# EAGLE design MDM_V3_ControlBoard_C (EAGLE 7.5.0)
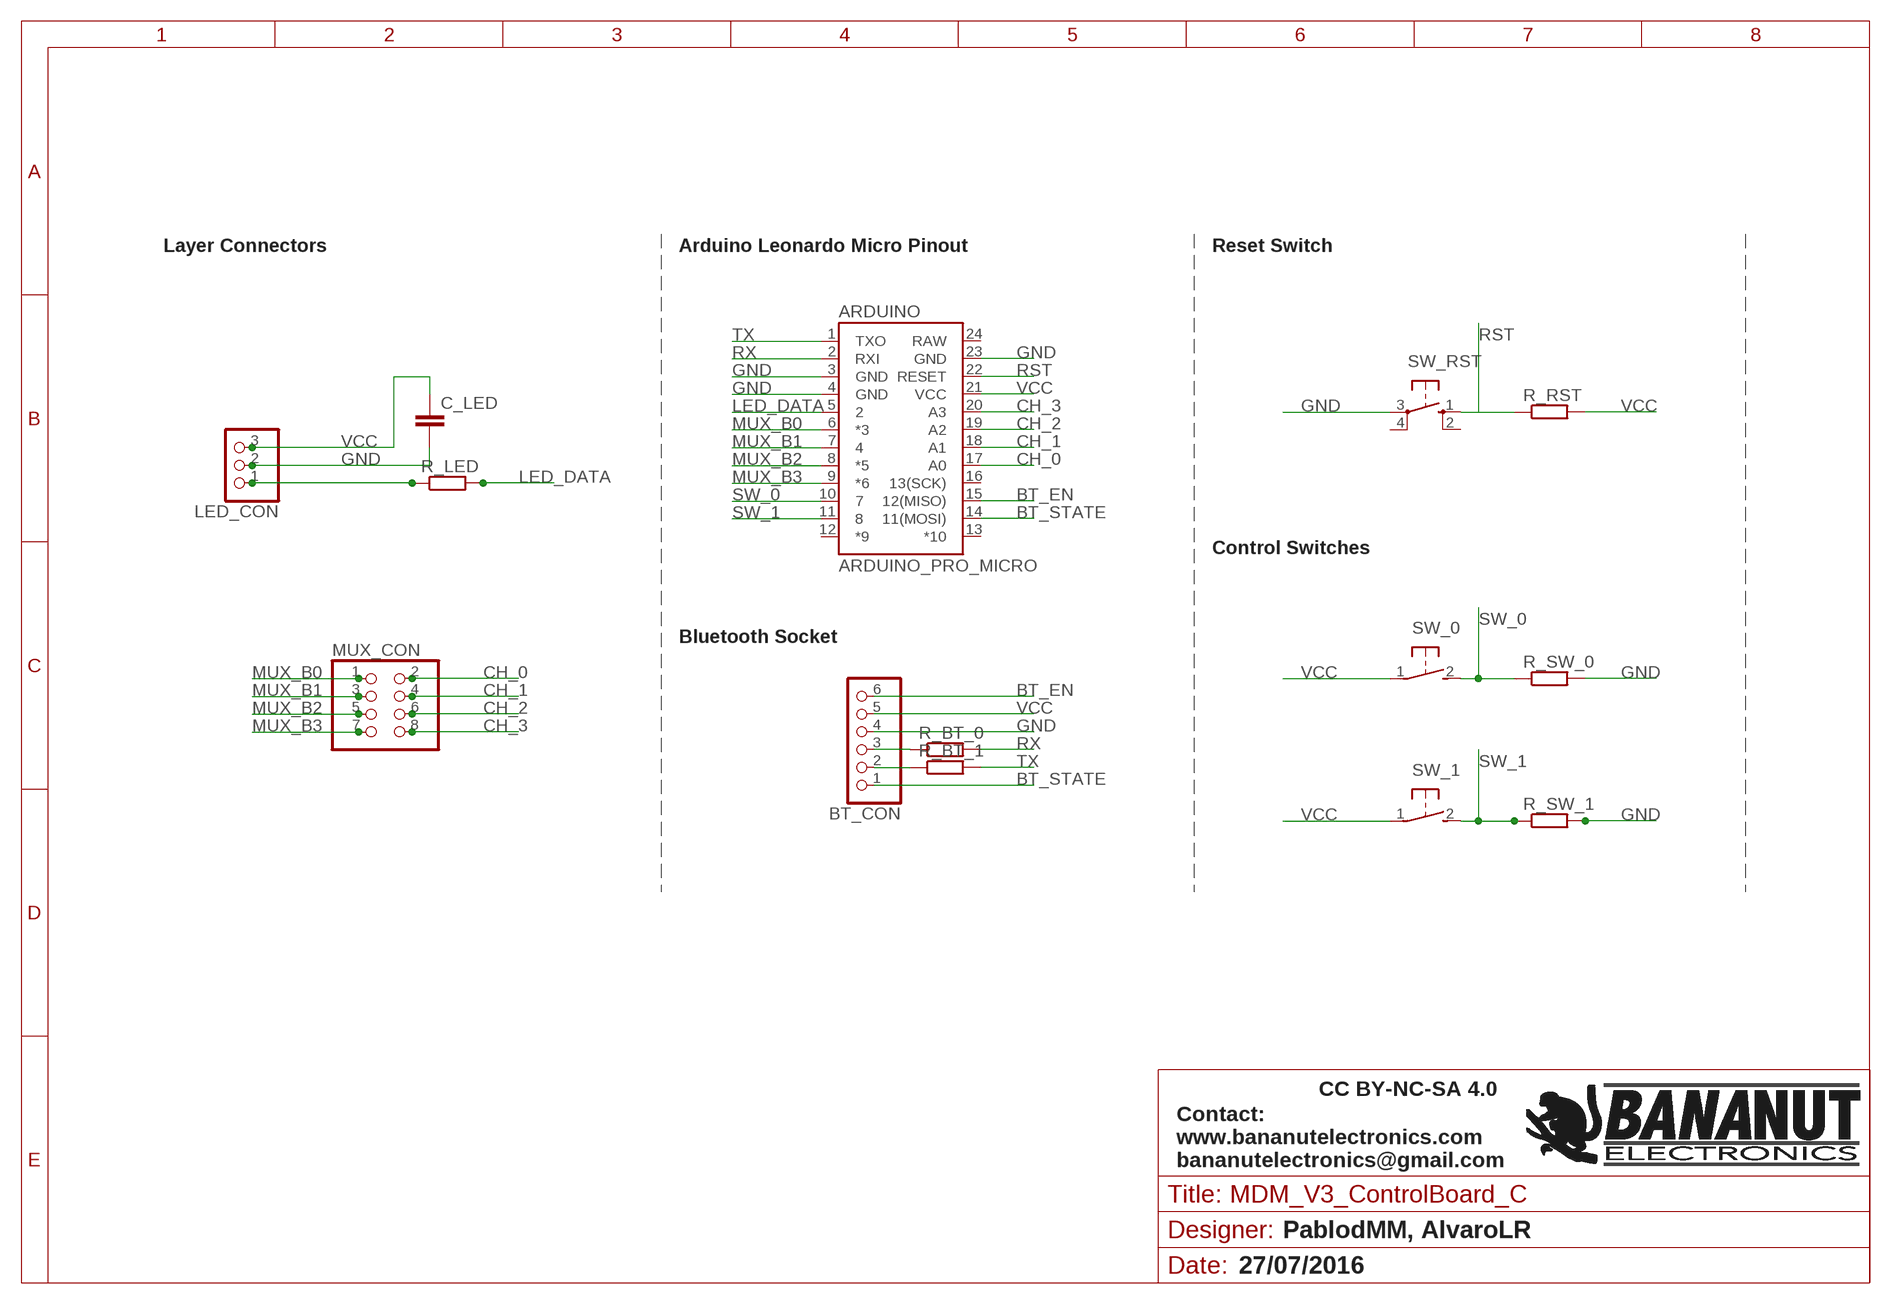
[diagram p0: schematic, sheet 1]

## Parts
ARDUINO  ARDUINO_PRO_MICRO  [ARDUINO_PRO_MICRO]
BT_CON  PINHD-1X6  [1X06]
C_LED  C-EUC1206K  [C1206K]
LED_CON  PINHD-1X3  [1X03]
MUX_CON  PINHD-2X4  [2X04]
R_BT_0  R-EU_M1206  [M1206]
R_BT_1  R-EU_M1206  [M1206]
R_LED  R-EU_M1206  [M1206]
R_RST  R-EU_M1206  [M1206]
R_SW_0  R-EU_M1206  [M1206]
R_SW_1  R-EU_M1206  [M1206]
SW_0  31-XX  [B3F-31XX]
SW_1  31-XX  [B3F-31XX]
SW_RST  10-XX  [B3F-10XX]

## Nets
BT_EN: ARDUINO.15(12(MISO)) BT_CON.6
BT_STATE: ARDUINO.14(11(MOSI)) BT_CON.1
CH_0: ARDUINO.17(A0) MUX_CON.2
CH_1: ARDUINO.18(A1) MUX_CON.4
CH_2: ARDUINO.19(A2) MUX_CON.6
CH_3: ARDUINO.20(A3) MUX_CON.8
GND [GND]: ARDUINO.3(GND) ARDUINO.4(GND) ARDUINO.23(GND) BT_CON.4 C_LED.2 LED_CON.2 R_SW_0.2 R_SW_1.2 SW_RST.3(P)
LED_DATA: ARDUINO.5 R_LED.2
MUX_B0: ARDUINO.6(*3) MUX_CON.1
MUX_B1: ARDUINO.7 MUX_CON.3
MUX_B2: ARDUINO.8(*5) MUX_CON.5
MUX_B3: ARDUINO.9(*6) MUX_CON.7
N$9: BT_CON.2 R_BT_1.1
N$10: BT_CON.3 R_BT_0.1
N$12: LED_CON.1 R_LED.1
RST: ARDUINO.22(RESET) R_RST.1 SW_RST.1(S)
RX: ARDUINO.2(RXI) R_BT_0.2
SW_0: ARDUINO.10 R_SW_0.1 SW_0.2(S)
SW_1: ARDUINO.11 R_SW_1.1 SW_1.2(S)
TX: ARDUINO.1(TXO) R_BT_1.2
VCC [GND]: ARDUINO.21(VCC) BT_CON.5 C_LED.1 LED_CON.3 R_RST.2 SW_0.1(P) SW_1.1(P)
Unconnected: ARDUINO.12(*9) ARDUINO.13(*10) ARDUINO.16(13(SCK)) ARDUINO.24(RAW) SW_RST.2(S1) SW_RST.4(P1)

## Notes on the sheet
- Layer Connectors | Arduino Leonardo Micro Pinout | Reset Switch
- Control Switches
- Bluetooth Socket
- CC BY-NC-SA 4.0
- Contact:
  www.bananutelectronics.com
  bananutelectronics@gmail.com
- PablodMM, AlvaroLR
- 27/07/2016

## Library data of the parts
ARDUINO = SparkFun-Boards:ARDUINO_PRO_MICRO
BT_CON = pinhead:PINHD-1X6: PIN HEADER
C_LED = resistor:C-EU: CAPACITOR, European symbol
LED_CON = adafruit:PINHD-1X3: PIN HEADER
MUX_CON = pinhead:PINHD-2X4: PIN HEADER
R_BT_0 R_BT_1 R_LED R_RST R_SW_0 R_SW_1 = resistor:R-EU_: RESISTOR, European symbol
SW_0 SW_1 = switch-omron:31-XX: OMRON SWITCH; MPN: B3F-3100; OC_FARNELL: 959704; OC_NEWARK: 36M3582
SW_RST = switch-omron:10-XX: OMRON SWITCH; MPN: B3F-1000; OC_FARNELL: 176432; OC_NEWARK: 36M3542

## Net classes
0 default: width 0.635 mm
1 GND: width 1.016 mm, clearance 0.254 mm

## Board
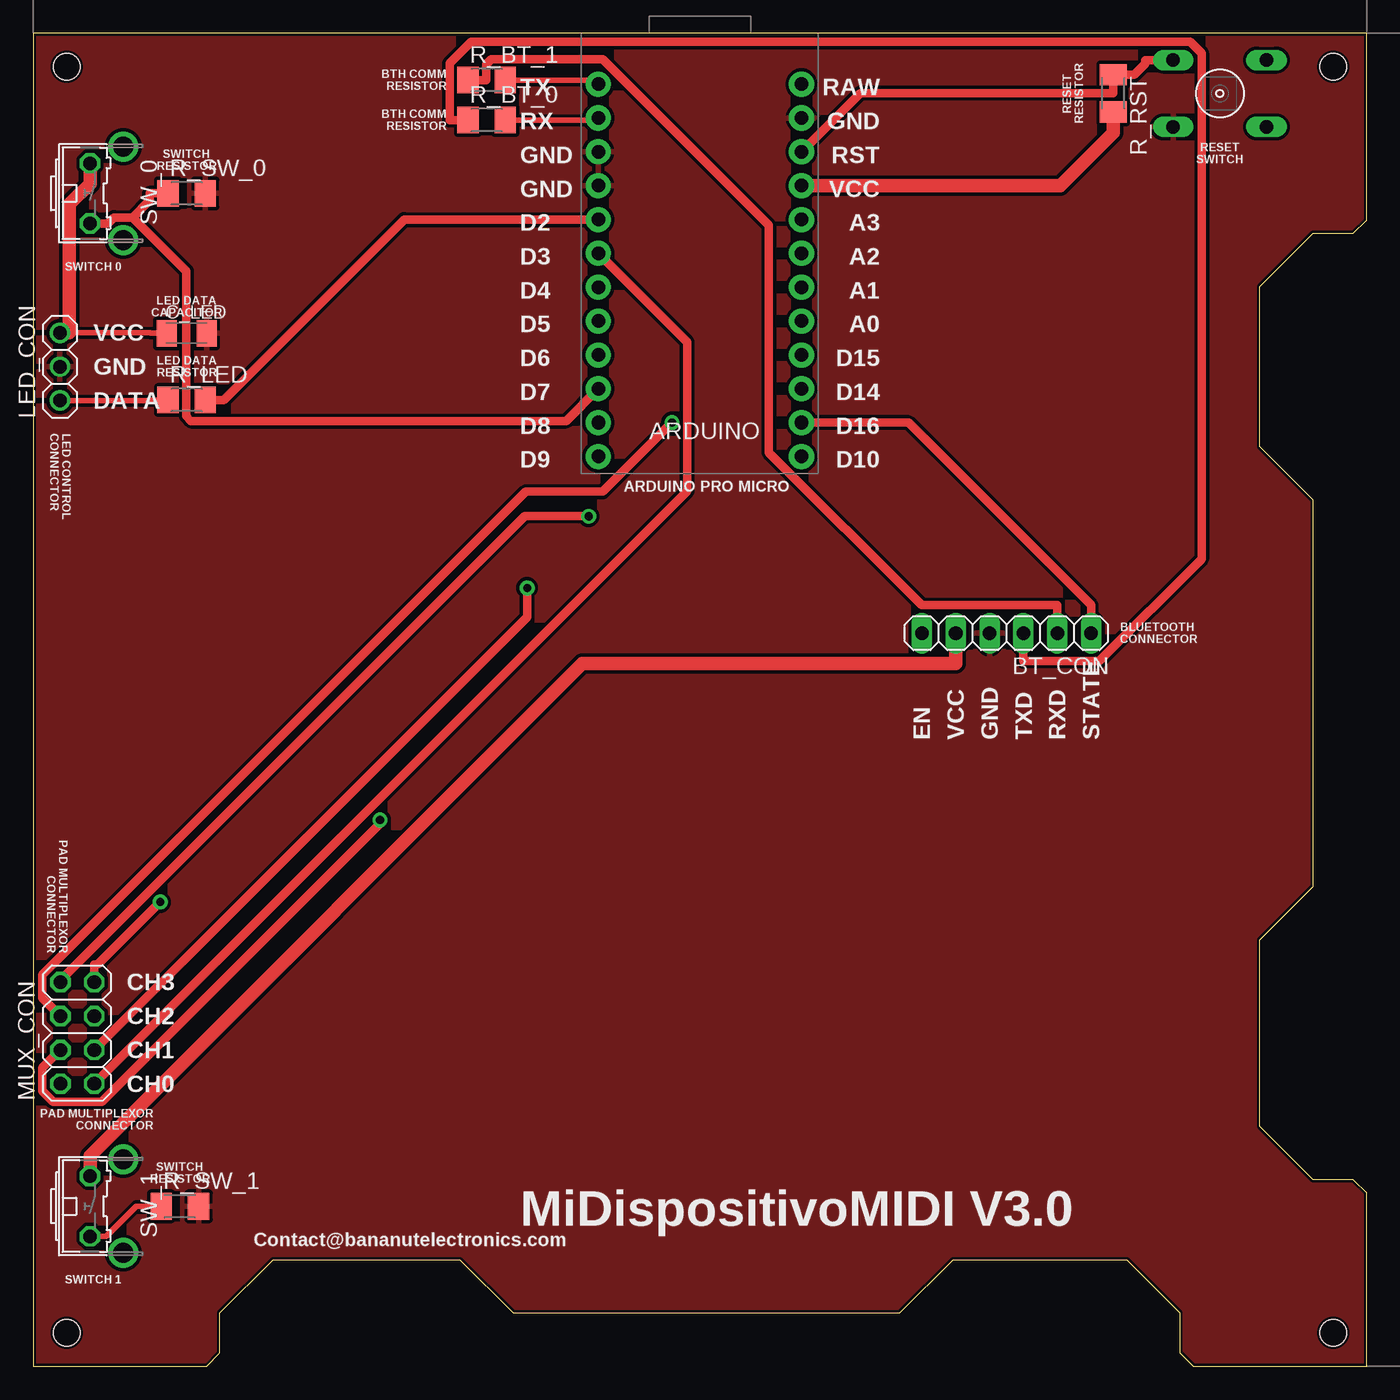
[diagram p1: board, top side]
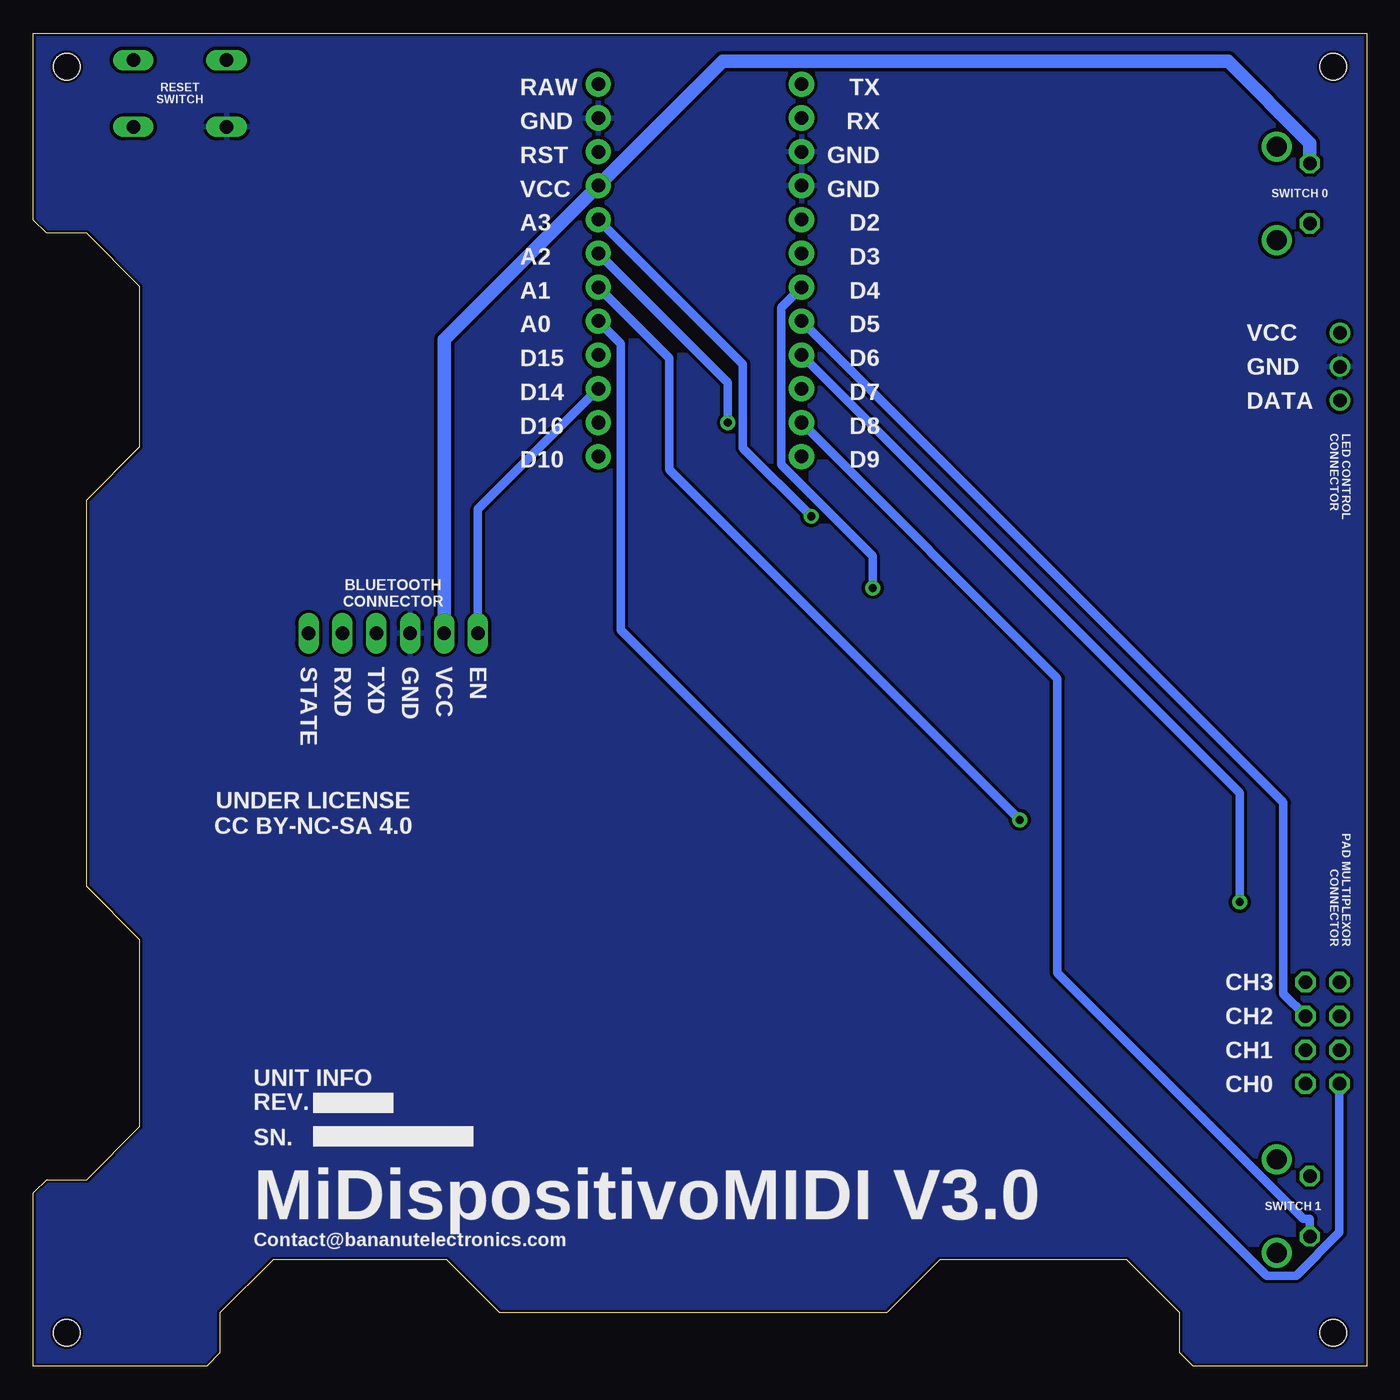
[diagram p2: board, bottom side, seen from below]

Size 100 x 100 mm. Coordinates in mm from the lower left corner, seen from the top.
Outline: 0,0 13,0 14,1 14,4 18,8 32,8 36,4 65,4 69,8 82,8 86,4 86,1 87,0 100,0 100,13 99,14 96,14 92,18 92,32 96,36 96,65 92,69 92,81 96,85 99,85 100,86 100,100 0,100 0,0
Copper layers (1*16): Top 0.035mm / dielectric 1.5mm / Bottom 0.035mm
Design rules "default *": minimum track width 10mil, minimum drill 24mil, track to track 10mil, track to pad 10mil, pad to pad 10mil, via to via 10mil, smd to smd 8mil, copper to edge 8mil, drill to drill 8mil, minimum pad ring 10mil, minimum via ring 10mil, stop-mask expansion 4mil, vias tented up to drill 0mil, thermal gap 10mil
Holes 2 mm at 2.5,97.5 2.5,2.5 97.5,2.5 97.5,97.5

### Footprints (pad centres in the part's own frame; a part is rotated, then mirrored left to right if it is on the bottom)
ARDUINO_PRO_MICRO = drill 1.016 pad 1.88: 1 -7.62,12.7; 2 -7.62,10.16; 3 -7.62,7.62; 4 -7.62,5.08; 5 -7.62,2.54; 6 -7.62,0; 7 -7.62,-2.54; 8 -7.62,-5.08; 9 -7.62,-7.62; 10 -7.62,-10.16; 11 -7.62,-12.7; 12 -7.62,-15.24; 13 7.62,-15.24; 14 7.62,-12.7; 15 7.62,-10.16; 16 7.62,-7.62; 17 7.62,-5.08; 18 7.62,-2.54; 19 7.62,0; 20 7.62,2.54; 21 7.62,5.08; 22 7.62,7.62; 23 7.62,10.16; 24 7.62,12.7
1X06 = drill 1.016 long: 1 -6.35,0; 2 -3.81,0; 3 -1.27,0; 4 1.27,0; 5 3.81,0; 6 6.35,0
C1206K = smd 1.5 x 2: 1 -1.5,0; 2 1.5,0
1X03 = drill 1.016: 1 -2.54,0; 2 0,0; 3 2.54,0
2X04 = drill 1.016 octagon: 1 -3.81,-1.27; 2 -3.81,1.27; 3 -1.27,-1.27; 4 -1.27,1.27; 5 1.27,-1.27; 6 1.27,1.27; 7 3.81,-1.27; 8 3.81,1.27
M1206 = smd 1.6 x 2: 1 -1.4,0; 2 1.4,0
B3F-31XX = drill 1.016 octagon: 1 -2.261,-1.245; 2 2.261,-1.245 | drill 1.499 pad 2.159: 3 -3.505,1.245; 4 3.505,1.245
B3F-10XX = drill 1.016 long: 1 -3.5,2.5; 2 3.5,2.5; 3 -3.5,-2.5; 4 3.5,-2.5

### Placement (x,y rotation side)
ARDUINO  50,83.5 0 top
BT_CON  73,55 180 top
C_LED  11.5,77.5 0 top
LED_CON  2,75 90 top
MUX_CON  3.3,25 90 top
R_BT_0  34,93.5 0 top
R_BT_1  34,96.5 0 top
R_LED  11.5,72.5 0 top
R_RST  81,95.5 270 top
R_SW_0  11.5,88 0 top
R_SW_1  11,12 0 top
SW_0  5.5,88 270 top
SW_1  5.5,12 270 top
SW_RST  89,95.5 0 top

### Tracks (layer width: path | path; a pad name or v marks a point on that pad's centre or on a via)
BT_EN
  Bottom 0.635: BT_CON.6 66.65,64.31 ARDUINO.15
BT_STATE
  Top 0.635: BT_CON.1 79.35,57.1 65.65,70.8 ARDUINO.14
CH_0
  Bottom 0.635: MUX_CON.2 2.03,10.04 5.28,6.8 7.49,6.8 55.92,55.23 55.92,76.72 ARDUINO.17
CH_1  (via drill 0.61 pad 1.12)
  Top 0.635: MUX_CON.4 0.67,22.37 0.67,20.66 1.49,19.84 5.14,19.84 26.01,40.71 v26.01,41
  Bottom 0.635: v26.01,41 52.29,67.28 52.29,75.63 ARDUINO.18
CH_2  (via drill 0.61 pad 1.12)
  Top 0.635: MUX_CON.6 0.68,27.62 0.68,29.36 36.94,65.62 42.73,65.62 v47.9,70.8
  Bottom 0.635: v47.9,70.8 47.9,73.78 ARDUINO.19
CH_3  (via drill 0.61 pad 1.12)
  Top 0.635: v41.65,63.77 36.86,63.77 2.03,28.94 MUX_CON.8
  Bottom 0.635: ARDUINO.20 46.77,75.19 46.77,68.89 v41.65,63.77
GND
  pour Top (isolate 0.61): 0,100 0,0 13,0 14,1 14,4 18,8 32,8 36,4 65,4 69,8 82,8 86,4 86,1 87,0 100,0 100,13 99,14 96,14 92,18 92,32 96,36 96,65 92,69 92,81 96,85 99,85 100,86 100,100
  pour Bottom: 0,100 100,100 100,86 99,85 96,85 92,81 92,69 96,65 96,36 92,32 92,18 96,14 99,14 100,13 100,0 87,0 86,1 86,4 82,8 69,8 65,4 36,4 32,8 18,8 14,4 14,1 13,0 0,0
LED_DATA
  Top 0.635: R_LED.2 14.27,72.5 27.81,86.04 ARDUINO.5
MUX_B0
  Top 0.635: MUX_CON.1 49.03,65.66 49.03,76.84 ARDUINO.6
MUX_B1  (via drill 0.61 pad 1.12)
  Top 0.635: MUX_CON.3 37.04,56.2 v37.04,58.4
  Bottom 0.635: v37.04,58.4 37.04,60.78 43.9,67.64 43.9,79.44 ARDUINO.7
MUX_B2
  Bottom 0.635: MUX_CON.5 6.24,27.94 6.24,42.28 ARDUINO.8
MUX_B3  (via drill 0.61 pad 1.12)
  Top 0.635: MUX_CON.7 4.57,30.14 4.83,30.14 v9.51,34.82
  Bottom 0.635: v9.51,34.82 9.51,43.01 ARDUINO.9
N$1
  pour Bottom: 0,0 13,0 14,1 14,4 18,8 32,8 36,4 65,4 69,8 82,8 86,4 86,1 87,0 100,0 100,13 99,14 96,14 92,18 92,32 96,36 96,65 92,69 92,81 96,85 99,85 100,86 100,99.5 100,100 0,100
N$2
  pour Top: 0,0 13,0 14,1 14,4 18,8 32,8 36,4 65,4 69,8 82,8 86,4 86,1 87,0 100,0 100,13 99,14 96,14 92,18 92,32 96,36 96,65 92,69 92,81 96,85 99,85 100,86 100,100 0,100
N$9
  Top 0.635: BT_CON.2 76.81,57.1 66.64,57.1 55.17,68.56 55.17,85.61 42.71,98.08 34.35,98.08 33.97,97.7 33.97,96.5 R_BT_1.1
N$10
  Top 0.635: BT_CON.3 74.27,52.9 79.96,52.9 87.62,60.56 87.62,98.53 86.78,99.38 32.85,99.38 31.23,97.75 31.23,93.5 R_BT_0.1
N$12
  Top 0.406: R_LED.1 8.84,72.5 8.8,72.46 LED_CON.1
RST
  Top 0.635: SW_RST.1 83.4,98 83.4,97.73 82.57,96.9 R_RST.1 81,95.53 62.03,95.53 ARDUINO.22
RX
  Top 0.406: R_BT_0.2 42.22,93.5 ARDUINO.2
SW_0
  Top 0.635: 7.45,86.19 11.47,82.17 11.47,71.28 11.82,70.93 39.97,70.93 ARDUINO.10 | 7.45,86.19 6.04,86.19 5.59,85.74 SW_0.2 | 7.45,86.19 8.73,87.47 8.73,88 R_SW_0.1
SW_1
  Top 0.406: SW_1.2 5.47,9.74 7.74,12 R_SW_1.1
  Bottom 0.635: SW_1.2 4.25,11.07 4.75,11.07 23.18,29.5 23.18,51.6 ARDUINO.11
TX
  Top 0.406: R_BT_1.2 42.08,96.5 ARDUINO.1
VCC
  Top 0.406: LED_CON.3 2.69,77.54 8.75,77.54 8.79,77.5 C_LED.1
  Top 1.016: R_RST.2 81,92.54 77.04,88.58 ARDUINO.21 | 2.69,77.54 2.69,87.17 4.25,88.74 SW_0.1 | BT_CON.5 69.19,52.71 41.19,52.71 4.25,15.79 SW_1.1
  Bottom 1.016: SW_0.1 4.25,91.78 10.38,97.91 48.29,97.91 ARDUINO.21 69.19,77.01 BT_CON.5

### Text on the board
_tsilk: BTH COMM / RESISTOR | RESET / RESISTOR | BTH COMM / RESISTOR | RESET / SWITCH | SWITCH / RESISTOR | SWITCH 0 | TX / RX / GND / GND / D2 / D3 / D4 / D5 / D6 / D7 / D8 / D9 | RAW / GND / RST / VCC / A3 / A2 / A1 / A0 / D15 / D14 / D16 / D10 | LED DATA / CAPACITOR | VCC / GND / DATA | LED DATA / RESISTOR | LED CONTROL / CONNECTOR | ARDUINO PRO MICRO | BLUETOOTH / CONNECTOR | EN / VCC / GND / TXD / RXD / STATE | PAD MULTIPLEXOR / CONNECTOR | CH3 / CH2 / CH1 / CH0 | PAD MULTIPLEXOR / CONNECTOR | SWITCH / RESISTOR | MiDispositivoMIDI V3.0 | Contact@bananutelectronics.com | SWITCH 1
_bsilk: RESET / SWITCH | SWITCH 0 | TX / RX / GND / GND / D2 / D3 / D4 / D5 / D6 / D7 / D8 / D9 | RAW / GND / RST / VCC / A3 / A2 / A1 / A0 / D15 / D14 / D16 / D10 | VCC / GND / DATA | LED CONTROL / CONNECTOR | BLUETOOTH / CONNECTOR | EN / VCC / GND / TXD / RXD / STATE | UNDER LICENSE / CC BY-NC-SA 4.0 | PAD MULTIPLEXOR / CONNECTOR | CH3 / CH2 / CH1 / CH0 | UNIT INFO | REV. / SN. | SWITCH 1 | MiDispositivoMIDI V3.0 | Contact@bananutelectronics.com